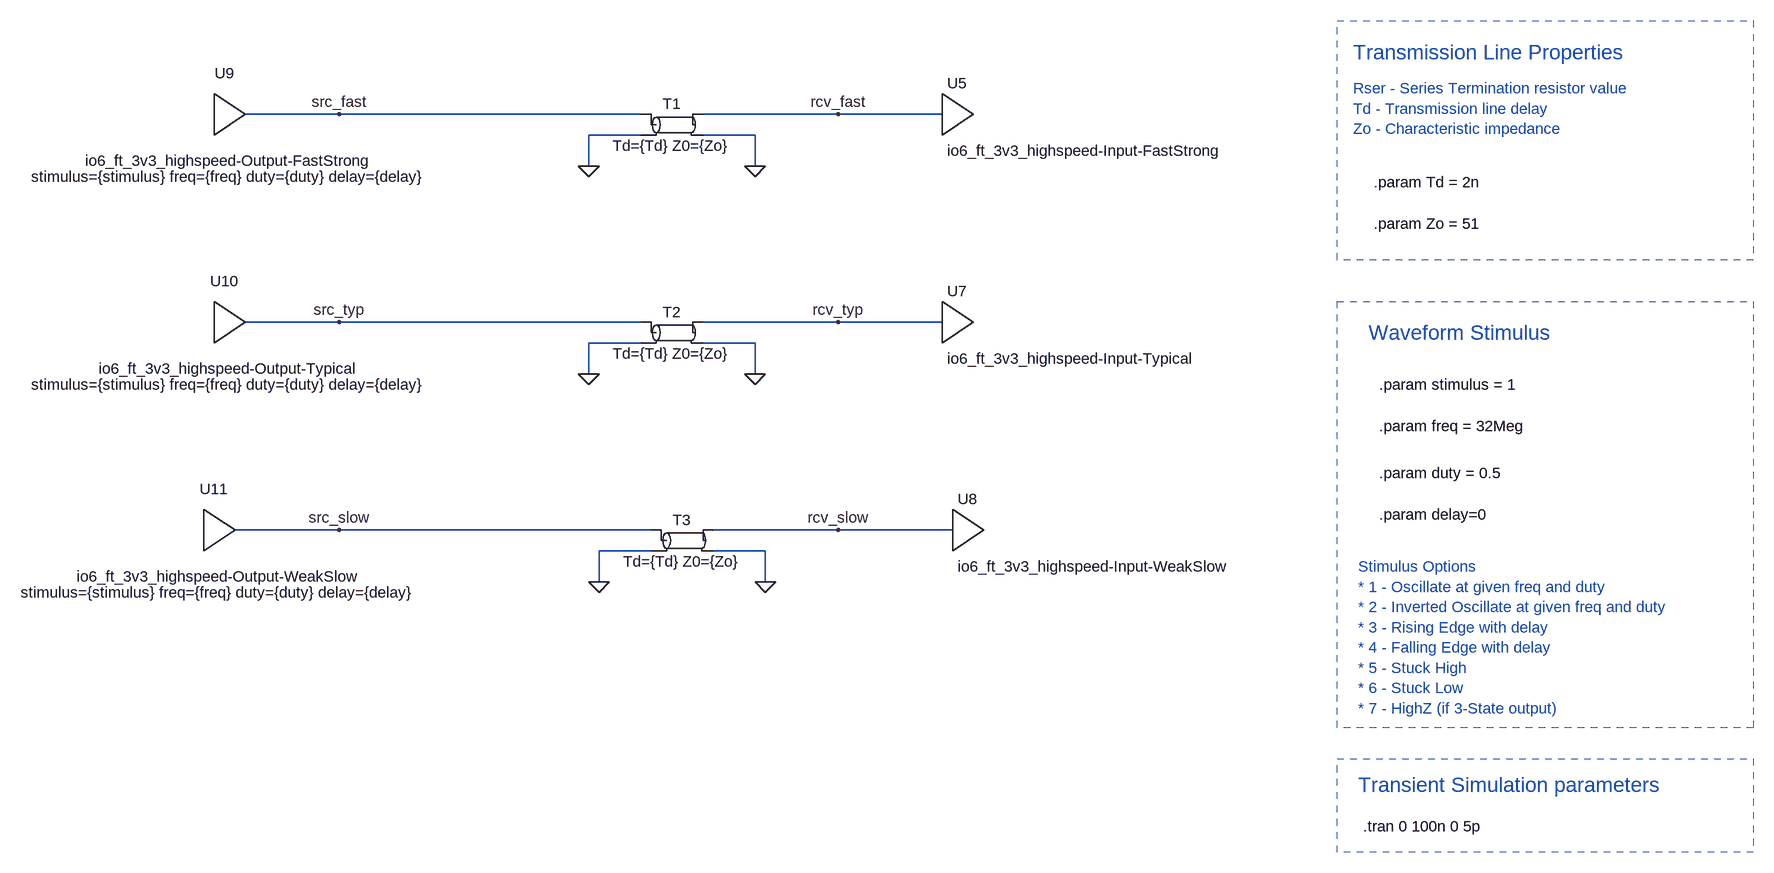
[diagram p0: schematic stm32g031_041_ufqfpn28.asc]
stm32g031_041_ufqfpn28.asc, the LTspice schematic file:
Version 4
SHEET 1 1856 1444
WIRE -816 288 -960 288
WIRE -352 288 -816 288
WIRE -48 288 -256 288
WIRE 112 288 -48 288
WIRE -352 320 -432 320
WIRE -176 320 -256 320
WIRE -432 368 -432 320
WIRE -176 368 -176 320
WIRE -816 608 -960 608
WIRE -352 608 -816 608
WIRE -48 608 -256 608
WIRE 112 608 -48 608
WIRE -352 640 -432 640
WIRE -176 640 -256 640
WIRE -432 688 -432 640
WIRE -176 688 -176 640
WIRE -816 928 -976 928
WIRE -336 928 -816 928
WIRE -48 928 -240 928
WIRE 128 928 -48 928
WIRE -336 960 -416 960
WIRE -160 960 -240 960
WIRE -416 1008 -416 960
WIRE -160 1008 -160 960
FLAG -432 368 0
FLAG -176 368 0
FLAG -48 288 rcv_fast
FLAG -48 608 rcv_typ
FLAG -48 928 rcv_slow
FLAG -816 288 src_fast
FLAG -816 608 src_typ
FLAG -816 928 src_slow
FLAG -432 688 0
FLAG -176 688 0
FLAG -416 1008 0
FLAG -160 1008 0
SYMBOL tline -304 304 R0
SYMATTR InstName T1
SYMATTR Value Td={Td} Z0={Zo}
SYMBOL tline -304 624 R0
SYMATTR InstName T2
SYMATTR Value Td={Td} Z0={Zo}
SYMBOL tline -288 944 R0
SYMATTR InstName T3
SYMATTR Value Td={Td} Z0={Zo}
SYMBOL io6_ft_3v3_highspeed-Input-FastStrong 112 224 R0
SYMATTR InstName U5
SYMBOL io6_ft_3v3_highspeed-Input-Typical 112 544 R0
SYMATTR InstName U7
SYMBOL io6_ft_3v3_highspeed-Input-WeakSlow 128 864 R0
SYMATTR InstName U8
SYMBOL io6_ft_3v3_highspeed-Output-FastStrong -992 320 R0
SYMATTR InstName U9
SYMATTR SpiceLine stimulus={stimulus} freq={freq} duty={duty} delay={delay}
SYMBOL io6_ft_3v3_highspeed-Output-Typical -992 640 R0
SYMATTR InstName U10
SYMATTR SpiceLine stimulus={stimulus} freq={freq} duty={duty} delay={delay}
SYMBOL io6_ft_3v3_highspeed-Output-WeakSlow -1008 960 R0
SYMATTR InstName U11
SYMATTR SpiceLine stimulus={stimulus} freq={freq} duty={duty} delay={delay}
TEXT 760 1384 Left 2 !.tran 0 100n 0 5p
TEXT 776 392 Left 2 !.param Td = 2n
TEXT 776 456 Left 2 !.param Zo = 51
TEXT 784 704 Left 2 !.param stimulus = 1
TEXT 784 768 Left 2 !.param freq = 32Meg
TEXT 784 840 Left 2 !.param duty = 0.5
TEXT 784 904 Left 2 !.param delay=0
TEXT 744 192 Left 3 ;Transmission Line Properties
TEXT 744 248 Left 2 ;Rser - Series Termination resistor value\nTd - Transmission line delay\nZo - Characteristic impedance
TEXT 752 984 Left 2 ;Stimulus Options\n* 1 - Oscillate at given freq and duty\n* 2 - Inverted Oscillate at given freq and duty\n* 3 - Rising Edge with delay\n* 4 - Falling Edge with delay\n* 5 - Stuck High\n* 6 - Stuck Low\n* 7 - HighZ (if 3-State output)
TEXT 752 1320 Left 3 ;Transient Simulation parameters
TEXT 768 624 Left 3 ;Waveform Stimulus
RECTANGLE Normal 1360 1424 720 1280 2
RECTANGLE Normal 1360 1232 720 576 2
RECTANGLE Normal 1360 512 720 144 2

The netlist it stands for:
* stm32g031_041_ufqfpn28.asc
T1 src_fast 0 rcv_fast 0 Td={Td} Z0={Zo}
T2 src_typ 0 rcv_typ 0 Td={Td} Z0={Zo}
T3 src_slow 0 rcv_slow 0 Td={Td} Z0={Zo}
XU5 rcv_fast io6_ft_3v3_highspeed-Input-FastStrong  ; pins IN
XU7 rcv_typ io6_ft_3v3_highspeed-Input-Typical  ; pins IN
XU8 rcv_slow io6_ft_3v3_highspeed-Input-WeakSlow  ; pins IN
XU9 src_fast io6_ft_3v3_highspeed-Output-FastStrong stimulus={stimulus} freq={freq} duty={duty} delay={delay}  ; pins OUT
XU10 src_typ io6_ft_3v3_highspeed-Output-Typical stimulus={stimulus} freq={freq} duty={duty} delay={delay}  ; pins OUT
XU11 src_slow io6_ft_3v3_highspeed-Output-WeakSlow stimulus={stimulus} freq={freq} duty={duty} delay={delay}  ; pins OUT
.tran 0 100n 0 5p
.param Td = 2n
.param Zo = 51
.param stimulus = 1
.param freq = 32Meg
.param duty = 0.5
.param delay=0
* Transmission Line Properties
* Rser - Series Termination resistor value
* Td - Transmission line delay
* Zo - Characteristic impedance
* Stimulus Options
* * 1 - Oscillate at given freq and duty
* * 2 - Inverted Oscillate at given freq and duty
* * 3 - Rising Edge with delay
* * 4 - Falling Edge with delay
* * 5 - Stuck High
* * 6 - Stuck Low
* * 7 - HighZ (if 3-State output)
* Transient Simulation parameters
* Waveform Stimulus
.lib io6_ft_3v3_highspeed-Input-FastStrong.sub
.lib io6_ft_3v3_highspeed-Input-Typical.sub
.lib io6_ft_3v3_highspeed-Input-WeakSlow.sub
.lib io6_ft_3v3_highspeed-Output-FastStrong.sub
.lib io6_ft_3v3_highspeed-Output-Typical.sub
.lib io6_ft_3v3_highspeed-Output-WeakSlow.sub
.backanno
.end